# Altium schematic sheet Cat_v1.SchDoc: Lilypad_32u4_v10
size B; Date: 4/14/2016 1:37:34 PM; SheetNumber: 1
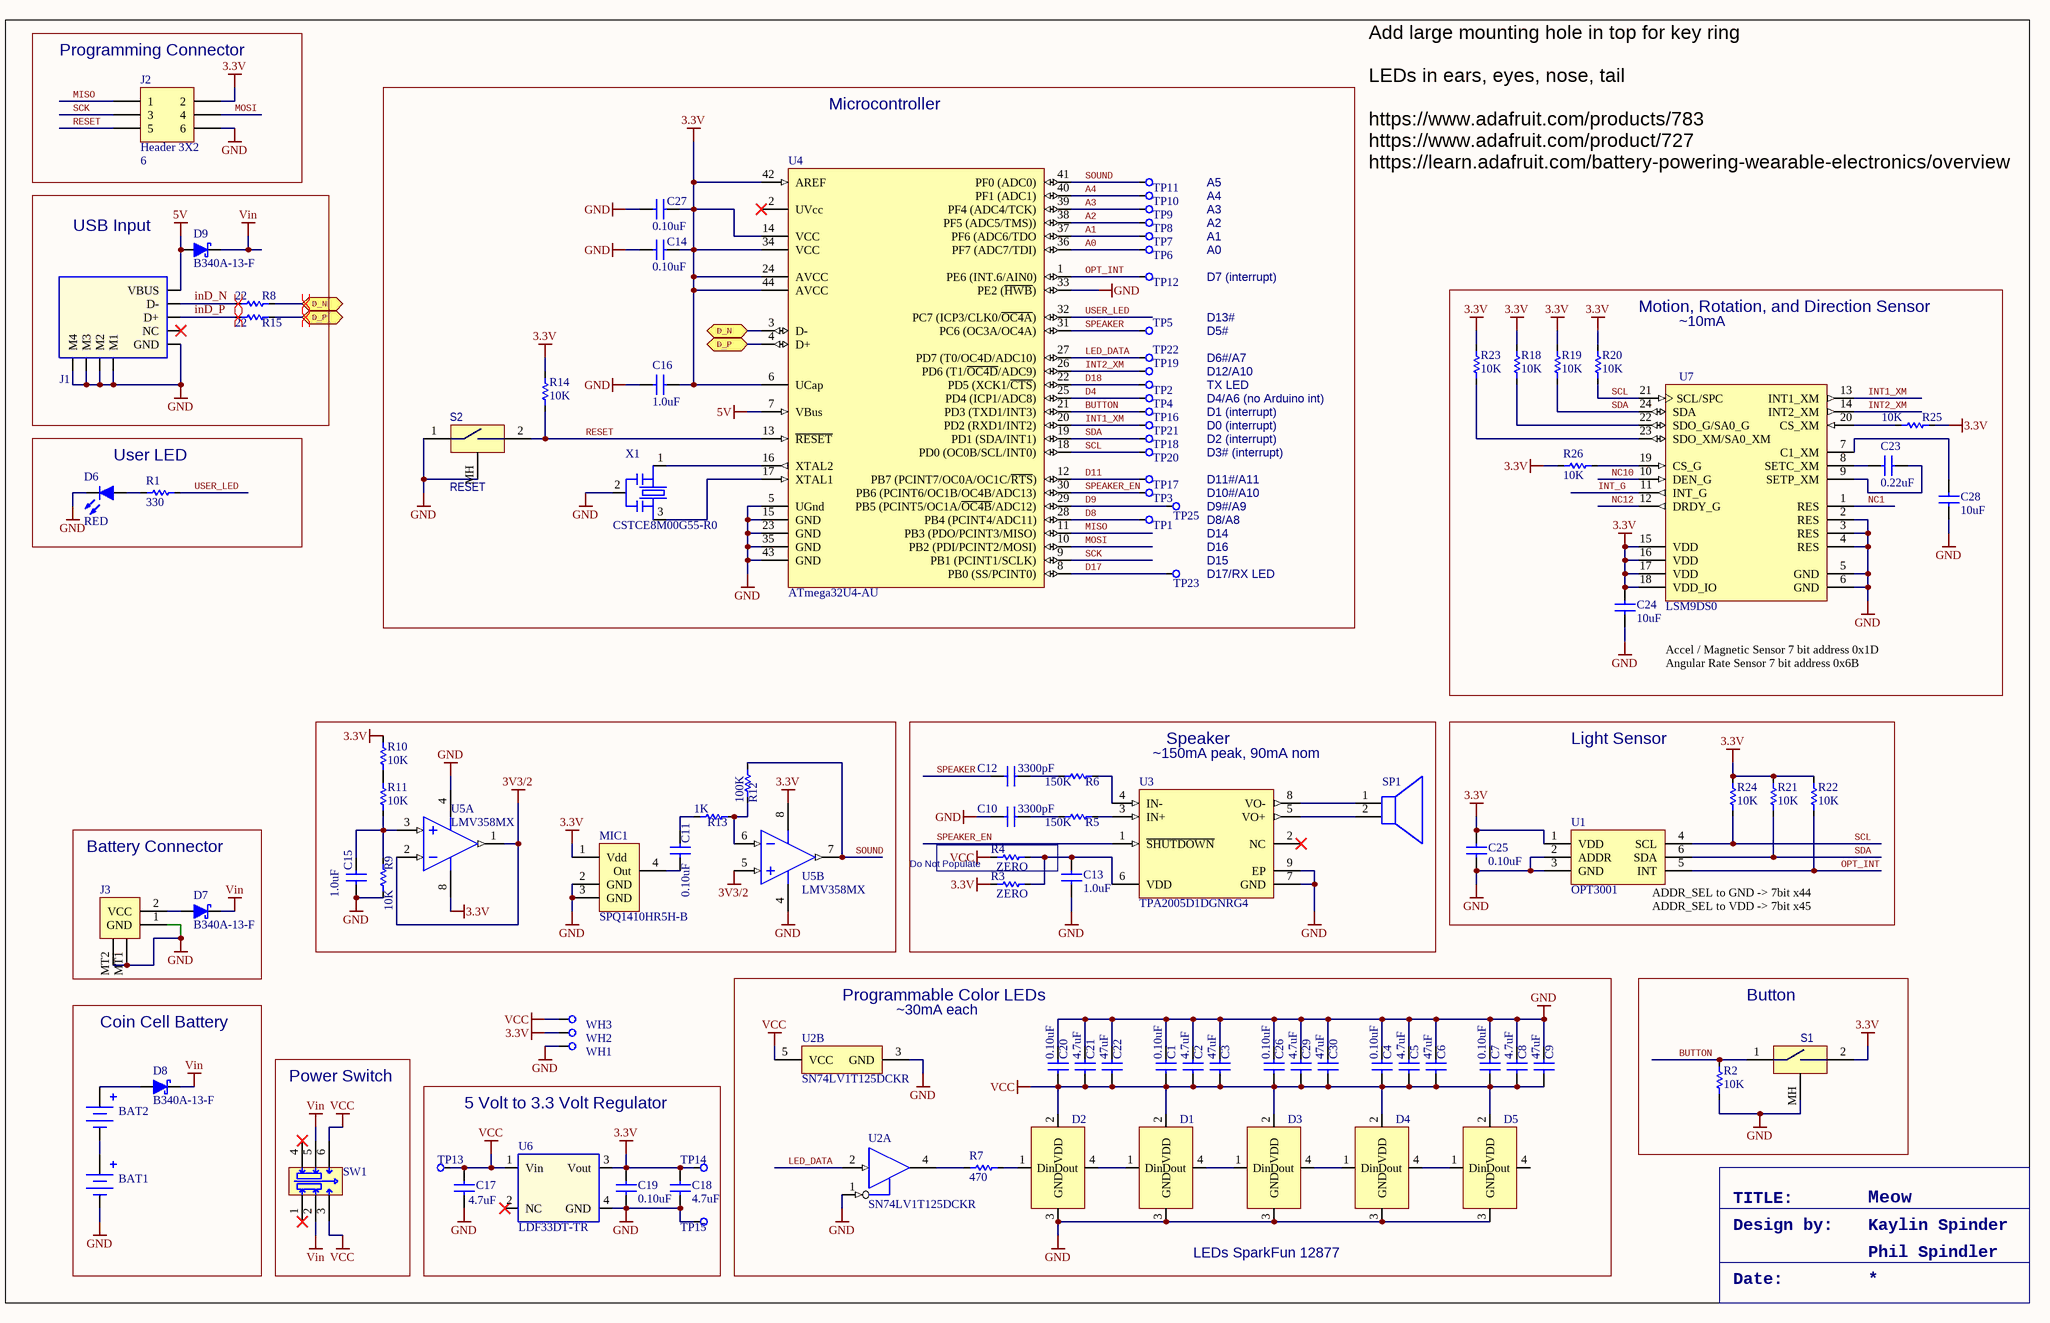
[diagram p0: Cat_v1.SchDoc]

## Parts
(Parts that share a designator on the sheet are numbered #1, #2 ... from top to bottom, then left to right.)
BAT1  BAT/Standard  [BAT/S8421-45R]  (value not drawn)
BAT2  BAT/Standard  [BAT/S8421-45R]  (value not drawn)
C1  value 0.10uF  [CAPC_MET_1608N]  (hidden comment: Capacitor)
C2  value 4.7uF  [CAPC_MET_1608N]  (hidden comment: Capacitor)
C3  value 47uF  [CAPC_MET_3216N]  (hidden comment: Capacitor)
C4  value 0.10uF  [CAPC_MET_1608N]  (hidden comment: Capacitor)
C5  value 4.7uF  [CAPC_MET_1608N]  (hidden comment: Capacitor)
C6  value 47uF  [CAPC_MET_3216N]  (hidden comment: Capacitor)
C7  value 0.10uF  [CAPC_MET_1608N]  (hidden comment: Capacitor)
C8  value 4.7uF  [CAPC_MET_1608N]  (hidden comment: Capacitor)
C9  value 47uF  [CAPC_MET_3216N]  (hidden comment: Capacitor)
C10  value 3300pF  [CAPC_MET_1608N]  (hidden comment: Capacitor)
C11  value 0.10uF  [CAPC_MET_1608N]  (hidden comment: Capacitor)
C12  value 3300pF  [CAPC_MET_1608N]  (hidden comment: Capacitor)
C13  value 1.0uF  [CAPC_MET_1608N]  (hidden comment: Capacitor)
C14  value 0.10uF  [CAPC_MET_1608N]  (hidden comment: Capacitor)
C15  value 1.0uF  [CAPC_MET_1608N]  (hidden comment: Capacitor)
C16  value 1.0uF  [CAPC_MET_1608N]  (hidden comment: Capacitor)
C17  value 4.7uF  [CAPC_MET_1608N]  (hidden comment: Capacitor)
C18  value 4.7uF  [CAPC_MET_1608N]  (hidden comment: Capacitor)
C19  value 0.10uF  [CAPC_MET_1608N]  (hidden comment: Capacitor)
C20  value 0.10uF  [CAPC_MET_1608N]  (hidden comment: Capacitor)
C21  value 4.7uF  [CAPC_MET_1608N]  (hidden comment: Capacitor)
C22  value 47uF  [CAPC_MET_3216N]  (hidden comment: Capacitor)
C23  value 0.22uF  [CAPC_MET_1608N]  (hidden comment: Capacitor)
C24  value 10uF  [CAPC_MET_1608N]  (hidden comment: Capacitor)
C25  value 0.10uF  [CAPC_MET_1608N]  (hidden comment: Capacitor)
C26  value 0.10uF  [CAPC_MET_1608N]  (hidden comment: Capacitor)
C27  value 0.10uF  [CAPC_MET_1608N]  (hidden comment: Capacitor)
C28  value 10uF  [CAPC_MET_1608N]  (hidden comment: Capacitor)
C29  value 4.7uF  [CAPC_MET_1608N]  (hidden comment: Capacitor)
C30  value 47uF  [CAPC_MET_3216N]  (hidden comment: Capacitor)
D1  DIO/APA106  [DIO8MM_4PIN]  (value not drawn)
D2  DIO/APA106  [DIO8MM_4PIN]  (value not drawn)
D3  DIO/APA106  [DIO8MM_4PIN]  (value not drawn)
D4  DIO/APA106  [DIO8MM_4PIN]  (value not drawn)
D5  DIO/APA106  [DIO8MM_4PIN]  (value not drawn)
D6  value RED  [LED 0603]  (hidden comment: LED)
D7  Manufacturer Part Number 1: B340A-13-F  [SMA/DO-214AC_wide]  (hidden comment: DIO/Schottky)
D8  Manufacturer Part Number 1: B340A-13-F  [SMA/DO-214AC_wide]  (hidden comment: DIO/Schottky)
D9  Manufacturer Part Number 1: B340A-13-F  [SMA/DO-214AC_wide]  (hidden comment: DIO/Schottky)
J1  USB_miniB  [629105136821]  (value not drawn)
J2  Header 3X2  value 6  [M20-8760342]
J3  S2B-PH-SM4-TB  [S2B-PH-SM4-TB]  (value not drawn)
MIC1  SPQ1410HR5H-B  [SPQ1410HR5H-B]
R1  value 330  [RESC_MET_1608N]  (hidden comment: Resistor)
R2  value 10K  [RESC_MET_1608N]  (hidden comment: Resistor)
R3  value ZERO  [RESC_MET_1608N]  (hidden comment: Resistor)
R4  value ZERO  [RESC_MET_1608N]  (hidden comment: Resistor)
R5  value 150K  [RESC_MET_1608N]  (hidden comment: Resistor)
R6  value 150K  [RESC_MET_1608N]  (hidden comment: Resistor)
R7  value 470  [RESC_MET_1608N]  (hidden comment: Resistor)
R8  value 22  [RESC_MET_1608N]  (hidden comment: Resistor)
R9  value 10K  [RESC_MET_1608N]  (hidden comment: Resistor)
R10  value 10K  [RESC_MET_1608N]  (hidden comment: Resistor)
R11  value 10K  [RESC_MET_1608N]  (hidden comment: Resistor)
R12  value 100K  [RESC_MET_1608N]  (hidden comment: Resistor)
R13  value 1K  [RESC_MET_1608N]  (hidden comment: Resistor)
R14  value 10K  [RESC_MET_1608N]  (hidden comment: Resistor)
R15  value 22  [RESC_MET_1608N]  (hidden comment: Resistor)
R18  value 10K  [RESC_MET_1608N]  (hidden comment: Resistor)
R19  value 10K  [RESC_MET_1608N]  (hidden comment: Resistor)
R20  value 10K  [RESC_MET_1608N]  (hidden comment: Resistor)
R21  value 10K  [RESC_MET_1608N]  (hidden comment: Resistor)
R22  value 10K  [RESC_MET_1608N]  (hidden comment: Resistor)
R23  value 10K  [RESC_MET_1608N]  (hidden comment: Resistor)
R24  value 10K  [RESC_MET_1608N]  (hidden comment: Resistor)
R25  value 10K  [RESC_MET_1608N]  (hidden comment: Resistor)
R26  value 10K  [RESC_MET_1608N]  (hidden comment: Resistor)
S1  (no value)  [PTS820_noPegs]
S2  RESET  [PTS820_noPegs]
SP1  Speaker  [SPEAKER/15MM]  (value not drawn)
SW1  JS202011SCQN  [JS202011SCQN]  (value not drawn)
TP1  D8  [TP/SMT135x70/HOOK]  (value not drawn)  (no BOM)
TP2  D18  [TP/SMT135x70/HOOK]  (value not drawn)  (no BOM)
TP3  D10  [TP/SMT135x70/HOOK]  (value not drawn)  (no BOM)
TP4  D4  [TP/SMT135x70/HOOK]  (value not drawn)  (no BOM)
TP5  D5  [TP/SMT135x70/HOOK]  (value not drawn)  (no BOM)
TP6  A0  [TP/SMT135x70/HOOK]  (value not drawn)  (no BOM)
TP7  A1  [TP/SMT135x70/HOOK]  (value not drawn)  (no BOM)
TP8  A2  [TP/SMT135x70/HOOK]  (value not drawn)  (no BOM)
TP9  A3  [TP/SMT135x70/HOOK]  (value not drawn)  (no BOM)
TP10  A4  [TP/SMT135x70/HOOK]  (value not drawn)  (no BOM)
TP11  A5  [TP/SMT135x70/HOOK]  (value not drawn)  (no BOM)
TP12  D7  [TP/SMT135x70/HOOK]  (value not drawn)  (no BOM)
TP13  5V  [TP/SMT135x70/HOOK]  (value not drawn)  (no BOM)
TP14  3.3V  [TP/SMT135x70/HOOK]  (value not drawn)  (no BOM)
TP15  GND  [TP/SMT135x70/HOOK]  (value not drawn)  (no BOM)
TP16  D1  [TP/SMT135x70/HOOK]  (value not drawn)  (no BOM)
TP17  D11  [TP/SMT135x70/HOOK]  (value not drawn)  (no BOM)
TP18  SDA  [TP/SMT135x70/HOOK]  (value not drawn)  (no BOM)
TP19  D12  [TP/SMT135x70/HOOK]  (value not drawn)  (no BOM)
TP20  SCL  [TP/SMT135x70/HOOK]  (value not drawn)  (no BOM)
TP21  D0  [TP/SMT135x70/HOOK]  (value not drawn)  (no BOM)
TP22  D6  [TP/SMT135x70/HOOK]  (value not drawn)  (no BOM)
TP23  TP/Standard  [TP/SMT20X24]  (value not drawn)  (no BOM)
TP25  TP/Standard  [TP/SMT20X24]  (value not drawn)  (no BOM)
U1  OPT3001  [SON65P200X65_HS-7N]
U2#1  SN74LV1T125DCKR  [DCK0005A_L]  (part B of 2)
U2#2  SN74LV1T125DCKR  [DCK0005A_L]  (part A of 2)
U3  TPA2005D1DGNRG4  [TI-DGN8-1760X1425TP_N]
U4  ATmega32U4-AU  [44ML_M]
U5#1  LMV358MX  [M08A_N]  (part B of 2)
U5#2  LMV358MX  [M08A_N]  (part A of 2)
U6  LDF33DT-TR  [DPAK228P972X240-3N]
U7  LSM9DS0  [STM-LGA-24_V]
WH1  WIRE_HOLE  [24AWG HOLE]  (value not drawn)  (no BOM)
WH2  WIRE_HOLE  [24AWG HOLE]  (value not drawn)  (no BOM)
WH3  WIRE_HOLE  [24AWG HOLE]  (value not drawn)  (no BOM)
X1  Manufacturer Part Number 1: CSTCE8M00G55-R0  [CSTCE_G]  (hidden comment: CSTCE_G)

## Blocks framed on the sheet
Programming Connector: J2
Microcontroller: C14 C16 C27 R14 S2 TP1-TP12 TP16-TP23 TP25 U4 X1
USB Input: D9 J1 R8 R15
Motion, Rotation, and Direction Sensor: C23 C24 C28 R18-R20 R23 R25 R26 U7
User LED: D6 R1
Speaker: C10 C12 C13 R3-R6 SP1 U3
Light Sensor: C25 R21 R22 R24 U1
Battery Connector: D7 J3
Coin Cell Battery: BAT1 BAT2 D8
Programmable Color LEDs: C1-C9 C20-C22 C26 C29 C30 D1-D5 R7 U2#1 U2#2
Button: R2 S1
Power Switch: SW1
5 Volt to 3.3 Volt Regulator: C17-C19 TP13-TP15 U6

## Ports
D_N, D_P

## Nets
3.3V: C14.2 C16.2 C18.2 C19.2 C24.2 C25.2 C27.2 J2.2 MIC1.1(Vdd) R3.1 R10.1 R14.2 R18.2 R19.2 R20.2 R21.2 R22.2 R23.2 R24.2 R25.2 R26.2 S1.2 TP14.1 U1.1(VDD) U4.6(UCap) U4.14(VCC) U4.24(AVCC) U4.34(VCC) U4.42(AREF) U4.44(AVCC) U5#1.8(V+) U5#2.8(V+) U6.3(Vout) U7.15(VDD) U7.16(VDD) U7.17(VDD) U7.18(VDD_IO) WH2.1
3V3/2: U5#1.5(INB+) U5#2.1(OUTA) U5#2.2(INA-)
5V: D9.A J1.1(VBUS) U4.7(VBus)
GND: BAT1.2(-) C1.2 C2.2 C3.2 C4.2 C5.2 C6.2 C7.2 C8.2 C9.2 C10.1 C13.1 C14.1 C15.1 C16.1 C17.2 C18.1 C19.1 C20.2 C21.2 C22.2 C24.1 C25.1 C26.2 C27.1 C28.1 C29.2 C30.2 D1.3(GND) D2.3(GND) D3.3(GND) D4.3(GND) D5.3(GND) D6.K J1.5(GND) J1.6(M1) J1.7(M2) J1.8(M3) J1.9(M4) J2.6 J3.1(GND) J3.MT1(MT) J3.MT2(MT) MIC1.2(GND) MIC1.3(GND) R2.1 R9.1 S1.MH S2.1 S2.MH TP15.1 U1.2(ADDR) U1.3(GND) U2#1.3(GND) U2#2.1(~{OE}) U3.7(GND) U3.9(EP) U4.5(UGnd) U4.15(GND) U4.23(GND) U4.33(PE2_(~{HWB})) U4.35(GND) U4.43(GND) U5#1.4(V-) U5#2.4(V-) U6.4(GND) U7.2(RES) U7.3(RES) U7.4(RES) U7.5(GND) U7.6(GND) WH1.1 X1.2(GND)
VCC: C1.1 C2.1 C3.1 C4.1 C5.1 C6.1 C7.1 C8.1 C9.1 C17.1 C20.1 C21.1 C22.1 C26.1 C29.1 C30.1 D1.2(VDD) D2.2(VDD) D3.2(VDD) D4.2(VDD) D5.2(VDD) R4.1 SW1.3 SW1.6 TP13.1 U2#1.5(VCC) U6.1(Vin) WH3.1
Vin: D7.K D8.K D9.K SW1.2 SW1.5
A0: TP6.1 U4.36(PF7_(ADC7/TDI))
A1: TP7.1 U4.37(PF6_(ADC6/TDO)
A2: TP8.1 U4.38(PF5_(ADC5/TMS)))
A3: TP9.1 U4.39(PF4_(ADC4/TCK))
A4: TP10.1 U4.40(PF1_(ADC1))
BUTTON: R2.2 S1.1 TP16.1 U4.21(PD3_(TXD1/INT3))
D4: TP4.1 U4.25(PD4_(ICP1/ADC8))
D8: TP1.1 U4.28(PB4_(PCINT4/ADC11))
D9: TP25.1 U4.29(PB5_(PCINT5/OC1A/~{OC4B}/ADC12))
D11: TP17.1 U4.12(PB7_(PCINT7/OC0A/OC1C/~{RTS}))
D17: TP23.1 U4.8(PB0_(SS/PCINT0))
D18: TP2.1 U4.22(PD5_(XCK1/~{CTS}))
D_N: R8.2 U4.3(D-) ; port D_N
D_P: R15.2 U4.4(D+) ; port D_P
inD_N: J1.2(D-) R8.1
inD_P: J1.3(D+) R15.1
INT1_XM: TP21.1 U4.20(PD2_(RXD1/INT2)) U7.13(INT1_XM)
INT2_XM: TP19.1 U4.26(PD6_(T1/~{OC4D}/ADC9)) U7.14(INT2_XM)
INT_G: U7.11(INT_G)
LED_DATA: TP22.1 U2#2.2(A) U4.27(PD7_(T0/OC4D/ADC10))
MISO: J2.1 U4.11(PB3_(PDO/PCINT3/MISO))
MOSI: J2.4 U4.10(PB2_(PDI/PCINT2/MOSI))
NC1: U7.1(RES)
NC10: U7.10(DEN_G)
NC12: U7.12(DRDY_G)
OPT_INT: R22.1 TP12.1 U1.5(INT) U4.1(PE6_(INT.6/AIN0))
RESET: J2.5 R14.1 S2.2 U4.13(~{RESET})
SCK: J2.3 U4.9(PB1_(PCINT1/SCLK))
SCL: R20.1 R24.1 TP20.1 U1.4(SCL) U4.18(PD0_(OC0B/SCL/INT0)) U7.21(SCL/SPC)
SDA: R19.1 R21.1 TP18.1 U1.6(SDA) U4.19(PD1_(SDA/INT1)) U7.24(SDA)
SOUND: R12.2 TP11.1 U4.41(PF0_(ADC0)) U5#1.7(OUTB)
SPEAKER: C12.1 TP5.1 U4.31(PC6_(OC3A/OC4A))
SPEAKER_EN: TP3.1 U3.1(~{SHUTDOWN}) U4.30(PB6_(PCINT6/OC1B/OC4B/ADC13))
USER_LED: R1.2 U4.32(PC7_(ICP3/CLK0/~{OC4A}))
NetBAT1_1: BAT1.1(+) BAT2.2(-)
NetBAT2_1: BAT2.1(+) D8.A
NetC10_2: C10.2 R5.1
NetC11_1: C11.1 MIC1.4(Out)
NetC11_2: C11.2 R13.1
NetC12_2: C12.2 R6.1
NetC13_2: C13.2 R3.2 R4.2 U3.6(VDD)
NetC15_2: C15.2 R9.2 R11.1 U5#2.3(INA+)
NetC23_1: C23.1 U7.8(SETC_XM)
NetC23_2: C23.2 U7.9(SETP_XM)
NetC28_2: C28.2 U7.7(C1_XM)
NetD1_1: D1.1(Din) D2.4(Dout)
NetD1_4: D1.4(Dout) D3.1(Din)
NetD2_1: D2.1(Din) R7.2
NetD3_4: D3.4(Dout) D4.1(Din)
NetD4_4: D4.4(Dout) D5.1(Din)
NetD6_A: D6.A R1.1
NetD7_A: D7.A J3.2(VCC)
NetR5_2: R5.2 U3.3(IN+)
NetR6_2: R6.2 U3.4(IN-)
NetR7_1: R7.1 U2#2.4(Y)
NetR10_2: R10.2 R11.2
NetR12_1: R12.1 R13.2 U5#1.6(INB-)
NetR18_1: R18.1 U7.22(SDO_G/SA0_G)
NetR23_1: R23.1 U7.23(SDO_XM/SA0_XM)
NetR25_1: R25.1 U7.20(CS_XM)
NetR26_1: R26.1 U7.19(CS_G)
NetSP1_1: SP1.1 U3.8(VO-)
NetSP1_2: SP1.2 U3.5(VO+)
NetU4_16: U4.16(XTAL2) X1.1(XTAL1)
NetU4_17: U4.17(XTAL1) X1.3(XTAL2)

Not connected (* = marked no-connect by the designer): D5 4(Dout); J1 4(NC)*; SW1 1* 4*; U3 2(NC)*; U4 2(UVcc)*; U6 2(NC)*

## Layout directives
differential pair: D_N, D_P, inD_N, inD_P

## Notes on the sheet
- A5
- A4
- A3
- A2
- A1
- A0
- Add large mounting hole in top for key ring
  LEDs in ears, eyes, nose, tail
  https://www.adafruit.com/products/783
  https://www.adafruit.com/product/727
  https://learn.adafruit.com/battery-powering-wearable-electronics/overview
- D7 (interrupt)
- D13#
- D5#
- D6#/A7
- D12/A10
- TX LED
- ~10mA
- D4/A6 (no Arduino int)
- D1 (interrupt)
- D0 (interrupt)
- D2 (interrupt)
- D3# (interrupt)
- D11#/A11
- (near TP25) D10#/A10
- (near TP25) D9#/A9
- (near TP25) D8/A8
- D14
- D16
- (near TP23) D15
- (near TP23) D17/RX LED
- Accel / Magnetic Sensor 7 bit address 0x1D
  Angular Rate Sensor 7 bit address 0x6B
- ~150mA peak, 90mA nom
- Do Not Populate
- (near U1) ADDR_SEL to GND -> 7bit x44
  ADDR_SEL to VDD -> 7bit x45
- (near U2#1) ~30mA each
- LEDs SparkFun 12877
- TITLE:
- Design by:
- Phil Spindler
- Meow
- Kaylin Spinder
- Date:

## Library data of the parts
BAT1 BAT2 = S8421-45R: HOLDER BATT COIN CR2032/20MM; Manufacturer 1: Harwin; id: 517; tbl_component_type_id: 10; Manufacturer Part Number 1: S8421-45R; Supplier Part Number 1: 952-1737-1-ND; Cost: 0.75; tbl_suppliers_id: 1
C1 C4 C7 C11 C14 C19 C20 C25-C27 = GRM188R71C104KA01D: CAP CER 0.1UF 16V X7R 0603; Manufacturer 1: Murata; id: 625; tbl_component_type_id: 2; Manufacturer Part Number 1: GRM188R71C104KA01D; Manufacturer 2: Any; Manufacturer Part Number 2: See Description; Supplier Part Number 1: 490-1532-1-ND; Cost: 0.01; tbl_suppliers_id: 1
C2 C5 C8 C17 C18 C21 C29 = CL10B475KQ8NQNC: CAP CER 4.7UF 6.3V X7R 0603; Manufacturer 1: Samsung; id: 639; tbl_component_type_id: 2; Manufacturer Part Number 1: CL10B475KQ8NQNC; Supplier Part Number 1: 1276-2087-1-ND; Cost: 0.03; tbl_suppliers_id: 1
C3 C6 C9 C22 C30 = GRM31CR60J476ME19L: CAP CER 47UF 6.3V 20% X5R 1206; Manufacturer 1: Murata; id: 803; tbl_component_type_id: 2; Manufacturer Part Number 1: GRM31CR60J476ME19L; Manufacturer 2: Any; Manufacturer Part Number 2: See Description; Supplier Part Number 1: 490-3907-1-ND; Cost: 0.25; tbl_suppliers_id: 1
C10 C12 = CL10B332KB8NNNC: CAP CER 3300PF 50V X7R 0603; Manufacturer 1: Samsung; id: 894; tbl_component_type_id: 2; Manufacturer Part Number 1: CL10B332KB8NNNC; Manufacturer 2: Any; Manufacturer Part Number 2: See Description; Supplier Part Number 1: 1276-1758-1-ND; Cost: 0.01; tbl_suppliers_id: 1
C13 C15 C16 = C1608X7R1C105M: CAP CER 0603 16V X7R 20%; Manufacturer 1: TDK; id: 99; tbl_component_type_id: 2; Manufacturer Part Number 1: C1608X7R1C105M; Manufacturer 2: Any; Manufacturer Part Number 2: See Description; Supplier Part Number 1: 445-5131-2-ND; Cost: 0.04; tbl_suppliers_id: 1
C23 = C1608X7R1C224K080AC: CAP CER 0.22UF 16V X7R 0603; Manufacturer 1: TDK; id: 624; tbl_component_type_id: 2; Manufacturer Part Number 1: C1608X7R1C224K080AC; Manufacturer 2: Any; Manufacturer Part Number 2: See Description; Supplier Part Number 1: 445-1318-1-ND; Cost: 0.03; tbl_suppliers_id: 1
C24 C28 = GRM188R61C106MA73D: CAP CER 10UF 16V 20% X5R 0603; Manufacturer 1: Murata; id: 510; tbl_component_type_id: 2; Manufacturer Part Number 1: GRM188R61C106MA73D; Supplier Part Number 1: 490-7201-1-ND; Cost: 0.12; tbl_suppliers_id: 1
D1-D5 = APA106-F8-8: LED RGB DIFF 8MM ROUND T/H; Manufacturer 1: Misc; id: 883; tbl_component_type_id: 4; Manufacturer Part Number 1: APA106-F8-8; Manufacturer 2: Any; Manufacturer Part Number 2: See Description; Supplier Part Number 1: APA106-F8-8; Cost: 1; tbl_suppliers_id: 1
D6 = LTST-S270KRKT: LED RED CLEAR 0603 R/A SMD; Manufacturer 1: Lite-On; id: 689; tbl_component_type_id: 4; Manufacturer Part Number 1: LTST-S270KRKT; Supplier Part Number 1: 160-1479-1-ND; Cost: 0.1; tbl_suppliers_id: 1
D7-D9 = B340A-13-F: DIODE SCHOTTKY 40V 3A SMA; Manufacturer 1: Diodes Inc.; id: 888; tbl_component_type_id: 4; Manufacturer 2: Any; Manufacturer Part Number 2: See Description; Supplier Part Number 1: B340A-FDICT-ND; Cost: 0.23; tbl_suppliers_id: 1
J1 = 629105136821: USB Micro B; Manufacturer 1: Wurth; id: 886; tbl_component_type_id: 8; Manufacturer Part Number 1: 629105136821; Supplier Part Number 1: 732-3155-2-ND; Cost: 0.95; tbl_suppliers_id: 1
J2 = M20-8760342: 2X3POS DIL VERTICAL SMT HEADER; Manufacturer 1: Harwin; id: 776; tbl_component_type_id: 8; LatestRevisionDate: 17-Jul-2002; LatestRevisionNote: Re-released for DXP Platform.; Publisher: Altium Limited; Manufacturer Part Number 1: M20-8760342; Manufacturer 2: Molex; Manufacturer Part Number 2: 0015912060; Supplier Part Number 1: 952-1922-ND; Cost: 0.29; tbl_suppliers_id: 1
J3 = S2B-PH-SM4-TB: 2 Positions Header, Shrouded Connector 0.079" (2.00mm) Surface Mount, Right Angle Tin; Manufacturer 1: JST; id: 918; tbl_component_type_id: 8; Manufacturer Part Number 1: S2B-PH-SM4-TB; Supplier Part Number 1: 455-1749-1-ND; Cost: 0.42; tbl_suppliers_id: 1
MIC1 = SPQ1410HR5H-B: MIC MEMS ANALOG OMNI -42DB; Manufacturer 1: Knowles Acoustics; id: 905; tbl_component_type_id: 10; Manufacturer Part Number 1: SPQ1410HR5H-B; Manufacturer 2: Any; Manufacturer Part Number 2: See Description; Supplier Part Number 1: 423-1213-1-ND; Cost: 0.6; tbl_suppliers_id: 1
R1 = ERJ-1GEJ331C: RES SMD 330 OHM 5% 1/20W 0201; Manufacturer 1: Panasonic; id: 382; tbl_component_type_id: 1; Manufacturer Part Number 1: ERJ-1GEJ331C; Manufacturer Part Number 2: See Description; Supplier Part Number 1: P330AGTR-ND; Manufacturer 2: Any; Cost: 0.03; tbl_suppliers_id: 1
R2 R9-R11 R14 R18-R26 = ERJ-3EKF1002V: RES 0603 10K 1% 0.1W; Manufacturer 1: Panasonic; id: 3; tbl_component_type_id: 1; Manufacturer Part Number 1: ERJ-3EKF1002V; Supplier Part Number 1: P10.0KHTR-ND; tbl_suppliers_id: 1
R3 R4 = ERJ-3GEY0R00V: RES 0603 ZERO 0.1W; Manufacturer 1: Panasonic; id: 70; tbl_component_type_id: 1; Manufacturer Part Number 1: ERJ-3GEY0R00V; Supplier Part Number 1: P0.0GTR-ND; tbl_suppliers_id: 1
R5 R6 = ERJ-3EKF1503V: RES 0603 150K 1% 0.1W; Manufacturer 1: Panasonic; id: 230; tbl_component_type_id: 1; Manufacturer Part Number 1: ERJ-3EKF1503V; Manufacturer Part Number 2: See Description; Supplier Part Number 1: P150KHTR-ND; Manufacturer 2: Any; Cost: 0.01; tbl_suppliers_id: 1
R7 = RC0603FR-07470RL: RES SMD 470 OHM 1% 1/10W 0603; Manufacturer 1: Yageo; id: 887; tbl_component_type_id: 1; Manufacturer Part Number 1: RC0603FR-07470RL; Manufacturer Part Number 2: See Description; Supplier Part Number 1: 311-470HRCT-ND; Manufacturer 2: Any; Cost: 0.01; tbl_suppliers_id: 1
R8 R15 = RC0603JR-0722RL: RES SMD 22 OHM 5% 1/10W 0603; Manufacturer 1: Yageo; id: 890; tbl_component_type_id: 1; Manufacturer Part Number 1: RC0603JR-0722RL; Manufacturer Part Number 2: See Description; Supplier Part Number 1: 311-22GRCT-ND; Manufacturer 2: Any; Cost: 0; tbl_suppliers_id: 1
R12 = ERJ-3EKF1003V: RES 0603 100K 1% 0.1W; Manufacturer 1: Panasonic; id: 2; tbl_component_type_id: 1; Manufacturer Part Number 1: ERJ-3EKF1003V; Supplier Part Number 1: P100KHTR-ND; tbl_suppliers_id: 1
R13 = ERJ-3EKF1001V: RES 0603 1K 1% 0.1W; Manufacturer 1: Panasonic; id: 1; Manufacturer Part Number 1: ERJ-3EKF1001V; Supplier Part Number 1: P1.00KHTR-ND; tbl_component_type_id: 1; tbl_suppliers_id: 1
S1 S2 = PTS820 J20M SMTR LFS: SWITCH TACTILE SPST-NO 0.05A 12V; Manufacturer 1: C&K Components; id: 875; tbl_component_type_id: 10; Manufacturer Part Number 1: PTS820 J20M SMTR LFS; Manufacturer 2: Any; Manufacturer Part Number 2: See Description; Supplier Part Number 1: CKN10505CT-ND; Cost: 0.36; tbl_suppliers_id: 1
SP1 = CVS-1508: SPEAKER 8 OHM .3W 15MM ROUND; Manufacturer 1: CUI; id: 903; tbl_component_type_id: 10; Manufacturer Part Number 1: CVS-1508; Manufacturer 2: PUI Audio; Manufacturer Part Number 2: AST-01508MR-R; Supplier Part Number 1: 102-2498-ND; Cost: 2.09; tbl_suppliers_id: 1
SW1 = JS202011SCQN: SWITCH SLIDE DPDT 300MA 6V; Manufacturer 1: C&K Components; id: 909; tbl_component_type_id: 10; Manufacturer Part Number 1: JS202011SCQN; Manufacturer 2: Any; Manufacturer Part Number 2: See Description; Supplier Part Number 1: 401-2002-1-ND; Cost: 0.37; tbl_suppliers_id: 1
TP1-TP22 = 5015: SMT Test Point - 135mil x 70mil With Hook; Manufacturer 1: Keystone; Manufacturer Part Number 1: 5015; id: 120; tbl_component_type_id: 10; Supplier Part Number 1: 5015KCT-ND; Cost: 0.29; tbl_suppliers_id: 1
TP23 TP25 = SMT Test Point 20x24mil Square: id: 793; tbl_component_type_id: 10; Manufacturer 1: Test Point; Manufacturer Part Number 1: SMT Test Point 20x24mil Square
U1 = OPT3001DNPT: IC AMBIENT LIGHT SENSOR 6USON; Manufacturer 1: Texas Instruments; id: 884; tbl_component_type_id: 7; Manufacturer Part Number 1: OPT3001DNPT; Supplier Part Number 1: 296-38667-1-ND; Cost: 2.09; Manufacturer 2: Any; Manufacturer Part Number 2: See Description; tbl_suppliers_id: 1
U2#1 U2#2 = CMP-0859-00356-3: Single Power Supply, Single BUFFER GATE w/ 3-State Output (active low enable), DCK0005A, LARGE T&R; Manufacturer: Texas Instruments; tpd @ Nom Voltage(Max)(ns): 14.5,9.5,8.0,6.5; Output Drive (IOL/IOH)(Max)(mA): 8/-8; Voltage(Nom)(V): 1.8,2.5,3.3,5.5; Bits(#): 1; Rating: Catalog; Output Type: CMOS; Technology Family: LV1T; 3-State Output: Yes; Sub-Family: Non-Inverting Buffer/Driver; Logic: True; Input Type: TTL; Schmitt Trigger: No; VCC(Min)(V): 1.6; Special Features: 1.8V to 3.3V Up Translation,3.3V to 1.8V Down Translation,5V Input Tolerant; VCC(Max)(V): 5.5; ICC @ Nom Voltage(Max)(mA): 0.01; F @ Nom Voltage(Max)(Mhz): 50; DatasheetVersion: SCLS745A; Operating Temperature Range(C): -40 to 125; Generic Part Number: SN74LV1T125; PackageReference: DCK0005A; PartId: 1
  U2#2: Manufacturer Part Number 1: SN74LV1T125DCKR
U3 = CMP-0991-00100-1: 1.4-W Mono Class-D Audio Amplifier, -40 to 85 degC, 8-pin SOP (DGN8), Green (RoHS & no Sb/Br); Manufacturer: Texas Instruments; Supply Min(Min)(Volt): 2.5; Output Power(W): 1.18; SubFamily: Dynamic Speaker; Supply Max(Max)(Volt): 5.5; PSRR(dB): -75; Speaker Amp Type: Class-D; Code_JEDEC: MO-187; ComponentLink3URL: http://www.ti.com/litv/pdf/mpds046e; Eco-Plan: Green (RoHS & no Sb/Br); Speaker Channels: Mono; PackageVersion: 4073271/F, 05/2011; PackageReference: DGN8-1760X1425TP; ComponentLink2URL: http://www.ti.com/general/docs/lit/getliterature.tsp?genericPartNumber=TPA2005D1&fileType=pdf; ComponentLink1URL: http://www.ti.com/; Manufacturer Part Number 1: TPA2005D1DGNRG4; Mounting Technology: Surface Mount; ComponentLink2Description: Datasheet; DatasheetVersion: SLOS369F; ComponentLink3Description: Package Specification; PackageDescription: 8-Pin Plastic Small Outline, Body 3 x 3 mm, Pitch 0.65 mm; ComponentLink1Description: Manufacturer URL
U4 = CMP-0095-00285-2: 8-bit AVR Microcontroller, 2.7-5.5V, 16MHz, 32KB Flash, 1KB EEPROM, 2.5KB SRAM, USB Controller, 44-pin TQFP, Industrial Grade (-40°C to 85°C), Ext Osc; RevisionNote: DatasheetVersion updated. URLs added.; ComponentLink1Description: Manufacturer URL; PackageDescription: 44-Pin Plastic Thin Quad Flat Pack, 10 x 10 x 1.0 mm Body, 0.8 mm Pitch (TQFP); DatasheetVersion: revF, Nov-2010; ComponentLink2URL: http://www.atmel.com/dyn/resources/prod_documents/doc7766.pdf; ComponentLink1URL: http://www.atmel.com/; PackageReference: 44ML; ComponentLink2Description: ATmega16U4/32U4 Datasheet; PackageVersion: rev.G, Jul-2007; ComponentLink3URL: http://www.atmel.com/dyn/resources/prod_documents/7766S.pdf; ComponentLink3Description: ATmega16U4 ATmega32U4 Summary; Manufacturer Part Number 1: ATmega32U4-AU
U5#1 U5#2 = CMP-0055-00557-2: General Purpose, Low Voltage, Rail-to-Rail Output Operational Amplifiers, 8-pin Narrow SOIC; Manufacturer: National Semiconductor; PackageTopMarking: NSZXTT*LMV*358M; PowerWise: N; ComponentLink2Description: LMV358 Web Page; ComponentLink1URL: http://www.national.com/ds/LM/LMV358.pdf; DatasheetVersion: Sep-2009; ComponentLink1Description: LMV358 Datasheet; ComponentLink3Description: M08A Package Page; CompType: Amplifiers; PackageVersion: revM, May-2009; PinCount: 8; Code_JEDEC: MS-012-AA; PackageDescription: SOIC Narrow, 4.9 x 3.9 x 1.45mm, 8 Lead, 1.27mm Pitch; ComponentLink3URL: http://www.national.com/packaging/folders/m08a.html; ComponentLink2URL: http://www.national.com/pf/LM/LMV358.html; RoHS: N; RevisionNote: Component URLs added; PackageReference: M08A; Code_IPC: SOIC127P600-8; PartId: 1
  U5#2: Manufacturer Part Number 1: LMV358MX
U6 = LDF33DT-TR: IC REG LDO 3.3V 1A DPAK; Manufacturer 1: STMicroelectronics; id: 907; tbl_component_type_id: 7; Manufacturer Part Number 1: LDF33DT-TR; Supplier Part Number 1: 497-14661-1-ND; Cost: 1.09; Manufacturer 2: Any; Manufacturer Part Number 2: See Description; tbl_suppliers_id: 1
U7 = CMP-1273-00001-1: INEMO Inertial Module: 3D Accelerometer, 3D Gyroscope, 3D Magnetometer, 2.4 to 3.6 V, -40 to 85 degC, 24-Pin LGA, RoHS, Tray; Manufacturer: STMicroelectronics; IDD_XM: 350 uA Typ.; VDDIO: 1.71 V Min.; Bandwidth: 400 kHz; IDD_PDN: 6 uA Typ.; IDD_G_LP: 2 mA Typ.; IDD_G: 6.1 mA Typ.; DatasheetVersion: Rev. 2; VDD: 2.4 to 3.6 V; ComponentLink3Description: Package Specification; ComponentLink2Description: Datasheet; ComponentLink1URL: http://www.st.com/; Manufacturer Part Number 1: LSM9DS0; PackageDescription: 24-Pin Land Grid Array, Body 4 x 4 mm, Pitch 0.5 mm; Mounting Technology: Surface Mount; ComponentLink1Description: Manufacturer URL; RoHS: TRUE; Packing: Tray; ComponentLink3URL: http://www.st.com/st-web-ui/static/active/en/resource/technical/document/datasheet/DM00087365.pdf; Operating Temperature Range: -40 to 85 degC; ComponentLink2URL: http://www.st.com/st-web-ui/static/active/en/resource/technical/document/datasheet/DM00087365.pdf
WH1-WH3 = Wire Hole 24AWG: Via for 24AWG wire; Manufacturer 1: MECHANICAL (NON-BOM); id: 606; tbl_component_type_id: 10; Manufacturer Part Number 1: Wire Hole 24AWG
X1 = CSTCE8M00G55-R0: CER RES 8.0000MHZ 33PF SMD; Manufacturer 1: Murata; Value: 8.00 MHz; id: 889; tbl_component_type_id: 6; Manufacturer 2: Any; Manufacturer Part Number 2: See Description; Supplier Part Number 1: 490-1195-1-ND; Cost: 0.31; tbl_suppliers_id: 1